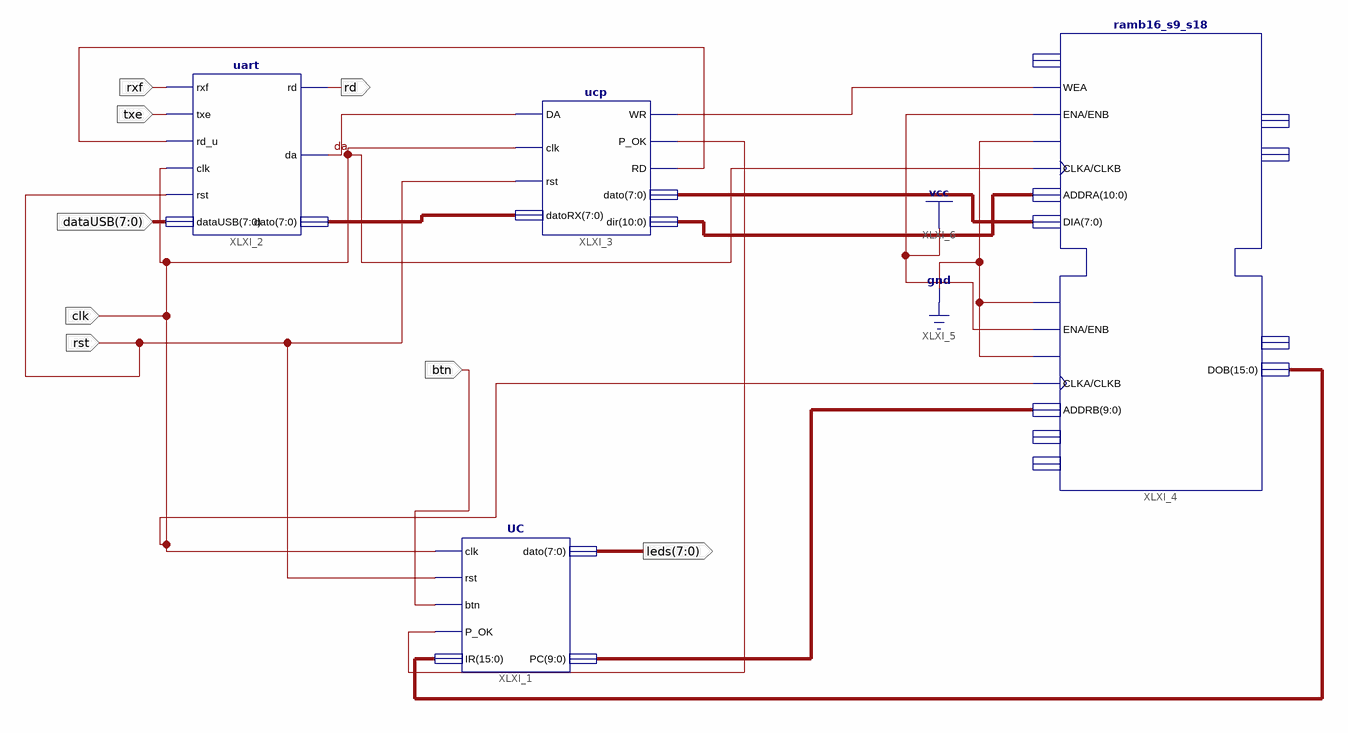
[diagram p0: schematic sheet 1]
// Xilinx ISE schematic tmp.sch (spartan3e) as structural Verilog: 4 symbols, 8 ports
module tmp (
  input  clk,
  input  rst,
  input  btn,
  input  rxf,
  input  txe,
  input  [7:0] dataUSB,
  output rd,
  output [7:0] leds
);

  wire da, XLXN_13, XLXN_14, XLXN_20;
  wire [7:0] XLXN_12, XLXN_21;
  wire [9:0] XLXN_26;
  wire [10:0] XLXN_22;
  wire [15:0] XLXN_24;

  UC XLXI_1 (.clk(clk), .rst(rst), .P_OK(XLXN_14), .btn(btn), .IR(XLXN_24), .dato(leds), .PC(XLXN_26));
  uart XLXI_2 (
    .rxf(rxf), .txe(txe), .rd_u(XLXN_13), .clk(clk), .rst(rst), .dataUSB(dataUSB), .rd(rd), .da(da),
    .dato(XLXN_12));
  ucp XLXI_3 (
    .DA(da), .clk(clk), .rst(rst), .datoRX(XLXN_12), .WR(XLXN_20), .P_OK(XLXN_14), .RD(XLXN_13),
    .dato(XLXN_21), .dir(XLXN_22));
  ramb16_s9_s18 #(.INIT_00("111111111111111111111111111111111111111111111111111111111111111"), .INITP_06("111111111111111111111111111111111111111111111111111111111111111"), .INITP_04("111111111111111111111111111111111111111111111111111111111111111"), .INITP_02("111111111111111111111111111111111111111111111111111111111111111"), .INITP_00("111111111111111111111111111111111111111111111111111111111111111")) XLXI_4 (
    .ADDRA(XLXN_22), .ADDRB(XLXN_26), .CLKA(clk), .CLKB(clk), .DIA(XLXN_21), .ENA(1'b1), .ENB(1'b1),
    .SSRA(1'b0), .SSRB(1'b0), .WEA(XLXN_20), .WEB(1'b0), .DOB(XLXN_24));  // open: DIB, DIPA, DIPB, DOA, DOPA, DOPB
endmodule
